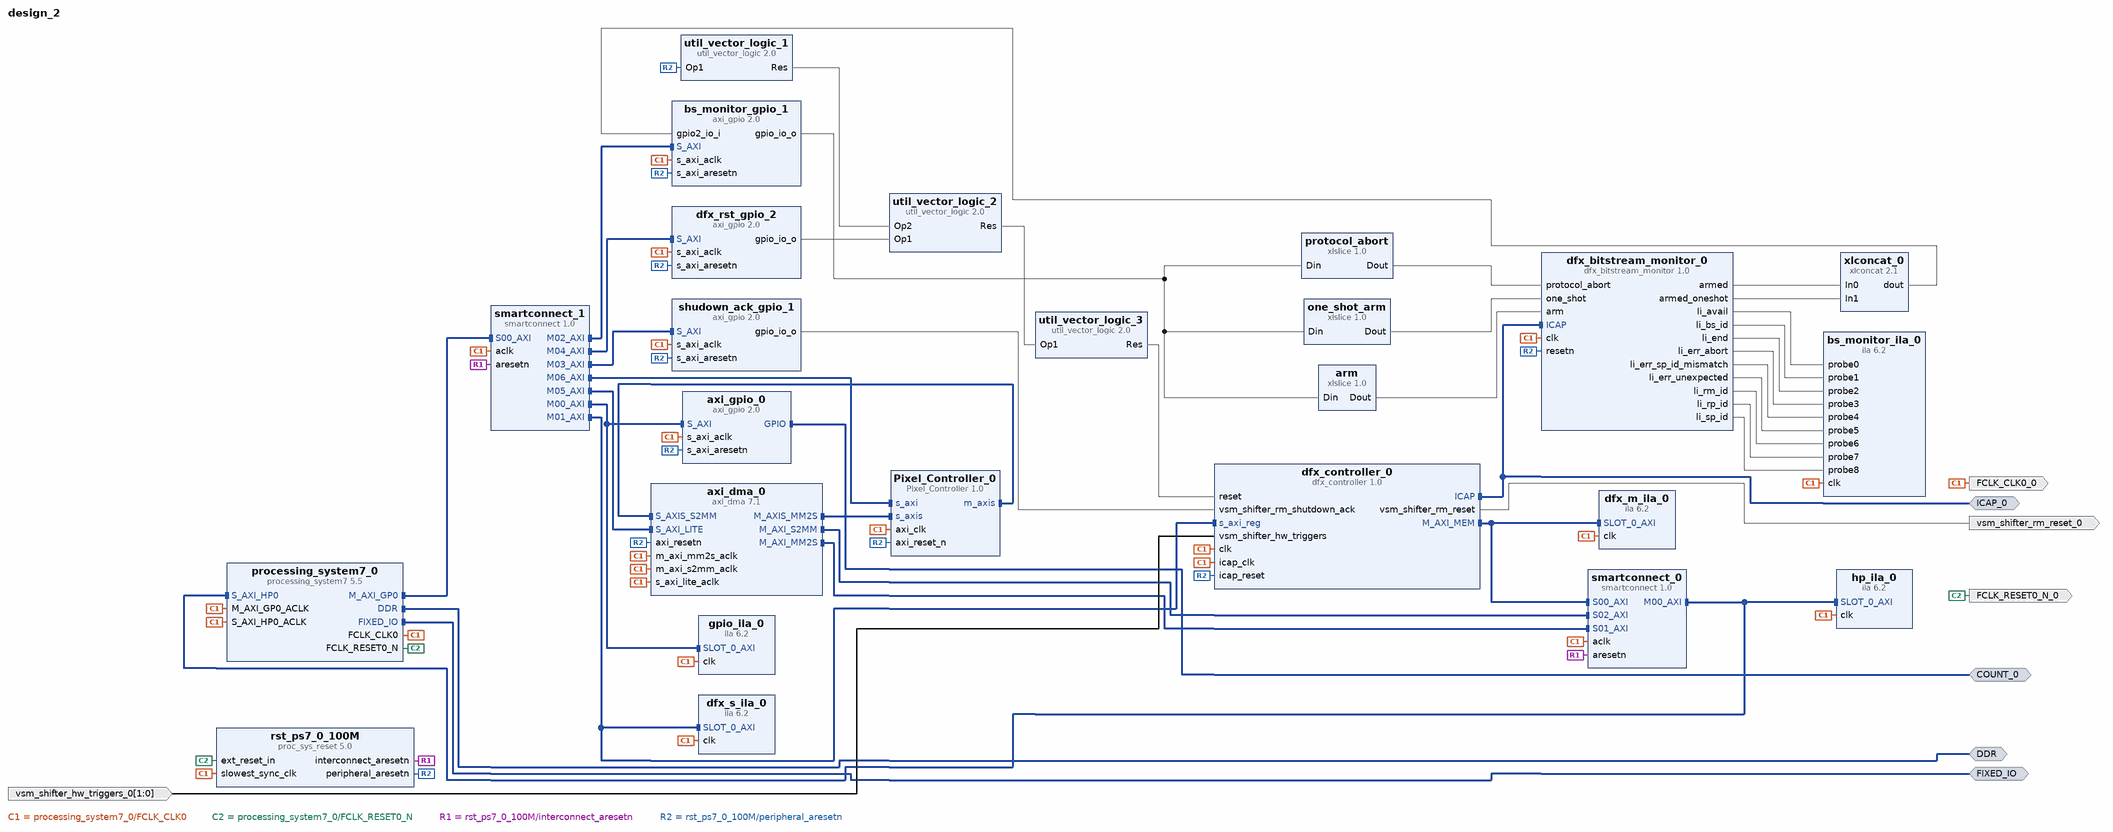
[diagram p0: block diagram of the top level]
# Vivado block design design_2, xc7z020clg400-1, Vivado 2020.1
create_bd_design design_2

create_bd_intf_port -mode Master -vlnv xilinx.com:interface:gpio_rtl:1.0 COUNT_0
create_bd_intf_port -mode Master -vlnv xilinx.com:interface:ddrx_rtl:1.0 DDR
create_bd_intf_port -mode Master -vlnv xilinx.com:display_processing_system7:fixedio_rtl:1.0 FIXED_IO
create_bd_intf_port -mode Master -vlnv xilinx.com:interface:icap_rtl:1.0 ICAP_0
create_bd_port -dir O -type clk FCLK_CLK0_0
create_bd_port -dir O -type rst FCLK_RESET0_N_0
create_bd_port -dir I -from 1 -to 0 vsm_shifter_hw_triggers_0
create_bd_port -dir O vsm_shifter_rm_reset_0

create_bd_cell -type ip -vlnv xilinx.com:ip:axi_gpio:2.0 axi_gpio_0
set_property -dict [list \
  CONFIG.C_ALL_OUTPUTS 1 \
  CONFIG.C_DOUT_DEFAULT 0x05F5E100 \
  CONFIG.C_GPIO_WIDTH 32 \
  CONFIG.GPIO_BOARD_INTERFACE Custom \
  CONFIG.USE_BOARD_FLOW true \
] [get_bd_cells axi_gpio_0]
create_bd_cell -type ip -vlnv xilinx.com:ip:dfx_controller:1.0 dfx_controller_0
set_property -dict [list \
  CONFIG.ALL_PARAMS {HAS_AXI_LITE_IF 1 RESET_ACTIVE_LEVEL 0 CP_FIFO_DEPTH 32 CP_FIFO_TYPE lutram CDC_STAGES 2 VS {shifter {ID 0 NAME shifter RM {shift_left {ID 0 NAME shift_left BS {0 {ID 0 ADDR 0 SIZE 0 CLEAR 0}} RESET_REQUIRED high} shift_right {ID 1 NAME shift_right BS {0 {ID 0 ADDR 0 SIZE 0 CLEAR 0}} RESET_REQUIRED high}} POR_RM shift_left HAS_POR_RM 1 SHUTDOWN_ON_ERROR 0 HAS_AXIS_STATUS 0 HAS_AXIS_CONTROL 0 SKIP_RM_STARTUP_AFTER_RESET 1 NUM_HW_TRIGGERS 2}} CP_FAMILY 7series DIRTY 0 CP_ARBITRATION_PROTOCOL 0} \
  CONFIG.GUI_CDC_STAGES 2 \
  CONFIG.GUI_CP_ARBITRATION_PROTOCOL 0 \
  CONFIG.GUI_HAS_AXI_LITE true \
  CONFIG.GUI_RESET_ACTIVE_LEVEL 0 \
  CONFIG.GUI_RM_NEW_NAME shift_left \
  CONFIG.GUI_RM_RESET_REQUIRED high \
  CONFIG.GUI_SELECT_RM 0 \
  CONFIG.GUI_SELECT_TRIGGER_1 1 \
  CONFIG.GUI_SELECT_TRIGGER_3 1 \
  CONFIG.GUI_VS_HAS_AXIS_CONTROL false \
  CONFIG.GUI_VS_HAS_AXIS_STATUS false \
  CONFIG.GUI_VS_HAS_POR_RM true \
  CONFIG.GUI_VS_NEW_NAME shifter \
  CONFIG.GUI_VS_NUM_HW_TRIGGERS 2 \
  CONFIG.GUI_VS_SHUTDOWN_ON_ERROR false \
  CONFIG.GUI_VS_SKIP_RM_STARTUP_AFTER_RESET true \
] [get_bd_cells dfx_controller_0]
create_bd_cell -type ip -vlnv xilinx.com:ip:processing_system7:5.5 processing_system7_0
set_property -dict [list \
  CONFIG.PCW_APU_PERIPHERAL_FREQMHZ 650 \
  CONFIG.PCW_CRYSTAL_PERIPHERAL_FREQMHZ 50 \
  CONFIG.PCW_ENET0_ENET0_IO {MIO 16 .. 27} \
  CONFIG.PCW_ENET0_GRP_MDIO_ENABLE 1 \
  CONFIG.PCW_ENET0_GRP_MDIO_IO {MIO 52 .. 53} \
  CONFIG.PCW_ENET0_PERIPHERAL_ENABLE 1 \
  CONFIG.PCW_ENET0_RESET_ENABLE 1 \
  CONFIG.PCW_ENET0_RESET_IO {MIO 9} \
  CONFIG.PCW_ENET_RESET_ENABLE 1 \
  CONFIG.PCW_ENET_RESET_SELECT {Share reset pin} \
  CONFIG.PCW_FPGA0_PERIPHERAL_FREQMHZ 100 \
  CONFIG.PCW_FPGA1_PERIPHERAL_FREQMHZ 50 \
  CONFIG.PCW_GPIO_MIO_GPIO_ENABLE 1 \
  CONFIG.PCW_GPIO_MIO_GPIO_IO MIO \
  CONFIG.PCW_I2C_RESET_ENABLE 1 \
  CONFIG.PCW_M_AXI_GP0_FREQMHZ 10 \
  CONFIG.PCW_PERIPHERAL_BOARD_PRESET part0 \
  CONFIG.PCW_PRESET_BANK1_VOLTAGE {LVCMOS 1.8V} \
  CONFIG.PCW_QSPI_GRP_FBCLK_ENABLE 1 \
  CONFIG.PCW_QSPI_GRP_FBCLK_IO {MIO 8} \
  CONFIG.PCW_QSPI_GRP_SINGLE_SS_ENABLE 1 \
  CONFIG.PCW_QSPI_GRP_SINGLE_SS_IO {MIO 1 .. 6} \
  CONFIG.PCW_QSPI_PERIPHERAL_ENABLE 1 \
  CONFIG.PCW_QSPI_QSPI_IO {MIO 1 .. 6} \
  CONFIG.PCW_SD0_GRP_CD_ENABLE 1 \
  CONFIG.PCW_SD0_GRP_CD_IO {MIO 47} \
  CONFIG.PCW_SD0_GRP_WP_ENABLE 0 \
  CONFIG.PCW_SD0_PERIPHERAL_ENABLE 1 \
  CONFIG.PCW_SD0_SD0_IO {MIO 40 .. 45} \
  CONFIG.PCW_SDIO_PERIPHERAL_FREQMHZ 50 \
  CONFIG.PCW_SINGLE_QSPI_DATA_MODE x4 \
  CONFIG.PCW_S_AXI_HP0_FREQMHZ 10 \
  CONFIG.PCW_UART0_PERIPHERAL_ENABLE 1 \
  CONFIG.PCW_UART0_UART0_IO {MIO 14 .. 15} \
  CONFIG.PCW_UART1_PERIPHERAL_ENABLE 0 \
  CONFIG.PCW_UART_PERIPHERAL_FREQMHZ 100 \
  CONFIG.PCW_UIPARAM_DDR_BUS_WIDTH {16 Bit} \
  CONFIG.PCW_UIPARAM_DDR_FREQ_MHZ 525 \
  CONFIG.PCW_UIPARAM_DDR_PARTNO {MT41J256M16 RE-125} \
  CONFIG.PCW_USB0_PERIPHERAL_ENABLE 1 \
  CONFIG.PCW_USB0_RESET_ENABLE 1 \
  CONFIG.PCW_USB0_RESET_IO {MIO 46} \
  CONFIG.PCW_USB0_USB0_IO {MIO 28 .. 39} \
  CONFIG.PCW_USB_RESET_ENABLE 1 \
  CONFIG.PCW_USB_RESET_SELECT {Share reset pin} \
  CONFIG.PCW_USE_S_AXI_HP0 1 \
] [get_bd_cells processing_system7_0]
# 498 more settings of processing_system7_0 are not shown: defaults, MIO pin electricals, DDR timing, and values the tool derives
create_bd_cell -type ip -vlnv xilinx.com:ip:proc_sys_reset:5.0 rst_ps7_0_100M
create_bd_cell -type ip -vlnv xilinx.com:ip:ila:6.2 gpio_ila_0
create_bd_cell -type ip -vlnv xilinx.com:ip:ila:6.2 dfx_s_ila_0
create_bd_cell -type ip -vlnv xilinx.com:ip:ila:6.2 dfx_m_ila_0
create_bd_cell -type ip -vlnv xilinx.com:ip:ila:6.2 hp_ila_0
create_bd_cell -type ip -vlnv xilinx.com:ip:dfx_bitstream_monitor:1.0 dfx_bitstream_monitor_0
set_property -dict [list \
  CONFIG.CTRL_INTERFACE_TYPE 0 \
  CONFIG.DP_DATA_FORMAT le_bs \
  CONFIG.DP_PROTOCOL ICAP \
  CONFIG.HAS_USR_ACCESS true \
] [get_bd_cells dfx_bitstream_monitor_0]
create_bd_cell -type ip -vlnv xilinx.com:ip:axi_gpio:2.0 bs_monitor_gpio_1
set_property -dict [list \
  CONFIG.C_ALL_INPUTS_2 1 \
  CONFIG.C_ALL_OUTPUTS 1 \
  CONFIG.C_DOUT_DEFAULT 0x00000000 \
  CONFIG.C_GPIO2_WIDTH 2 \
  CONFIG.C_GPIO_WIDTH 3 \
  CONFIG.C_IS_DUAL 1 \
  CONFIG.GPIO_BOARD_INTERFACE Custom \
  CONFIG.USE_BOARD_FLOW true \
] [get_bd_cells bs_monitor_gpio_1]
create_bd_cell -type ip -vlnv xilinx.com:ip:xlslice:1.0 arm
set_property -dict {CONFIG.DIN_WIDTH 3} [get_bd_cells arm]
create_bd_cell -type ip -vlnv xilinx.com:ip:xlslice:1.0 one_shot_arm
set_property -dict {CONFIG.DIN_FROM 1 CONFIG.DIN_TO 1 CONFIG.DIN_WIDTH 3 CONFIG.DOUT_WIDTH 1} [get_bd_cells one_shot_arm]
create_bd_cell -type ip -vlnv xilinx.com:ip:xlslice:1.0 protocol_abort
set_property -dict {CONFIG.DIN_FROM 2 CONFIG.DIN_TO 2 CONFIG.DIN_WIDTH 3 CONFIG.DOUT_WIDTH 1} [get_bd_cells protocol_abort]
create_bd_cell -type ip -vlnv xilinx.com:ip:xlconcat:2.1 xlconcat_0
set_property -dict {CONFIG.NUM_PORTS 2} [get_bd_cells xlconcat_0]
create_bd_cell -type ip -vlnv xilinx.com:ip:ila:6.2 bs_monitor_ila_0
set_property -dict [list \
  CONFIG.C_ENABLE_ILA_AXI_MON false \
  CONFIG.C_MONITOR_TYPE Native \
  CONFIG.C_NUM_OF_PROBES 9 \
  CONFIG.C_PROBE1_TYPE 1 \
  CONFIG.C_PROBE1_WIDTH 32 \
  CONFIG.C_PROBE6_TYPE 1 \
  CONFIG.C_PROBE6_WIDTH 32 \
  CONFIG.C_PROBE7_TYPE 1 \
  CONFIG.C_PROBE7_WIDTH 32 \
  CONFIG.C_PROBE8_TYPE 1 \
  CONFIG.C_PROBE8_WIDTH 32 \
] [get_bd_cells bs_monitor_ila_0]
create_bd_cell -type ip -vlnv xilinx.com:ip:axi_gpio:2.0 shudown_ack_gpio_1
set_property -dict {CONFIG.C_ALL_OUTPUTS 1 CONFIG.C_GPIO_WIDTH 1} [get_bd_cells shudown_ack_gpio_1]
create_bd_cell -type ip -vlnv xilinx.com:ip:smartconnect:1.0 smartconnect_0
set_property -dict {CONFIG.NUM_SI 3} [get_bd_cells smartconnect_0]
create_bd_cell -type ip -vlnv xilinx.com:ip:smartconnect:1.0 smartconnect_1
set_property -dict {CONFIG.NUM_MI 7 CONFIG.NUM_SI 1} [get_bd_cells smartconnect_1]
create_bd_cell -type ip -vlnv xilinx.com:ip:axi_gpio:2.0 dfx_rst_gpio_2
set_property -dict [list \
  CONFIG.C_ALL_OUTPUTS 1 \
  CONFIG.C_DOUT_DEFAULT 0xFFFFFFFF \
  CONFIG.C_GPIO_WIDTH 1 \
  CONFIG.GPIO_BOARD_INTERFACE Custom \
  CONFIG.USE_BOARD_FLOW true \
] [get_bd_cells dfx_rst_gpio_2]
create_bd_cell -type ip -vlnv xilinx.com:ip:util_vector_logic:2.0 util_vector_logic_1
set_property -dict {CONFIG.C_OPERATION not CONFIG.C_SIZE 1} [get_bd_cells util_vector_logic_1]
create_bd_cell -type ip -vlnv xilinx.com:ip:util_vector_logic:2.0 util_vector_logic_2
set_property -dict {CONFIG.C_OPERATION or CONFIG.C_SIZE 1} [get_bd_cells util_vector_logic_2]
create_bd_cell -type ip -vlnv xilinx.com:ip:util_vector_logic:2.0 util_vector_logic_3
set_property -dict {CONFIG.C_OPERATION not CONFIG.C_SIZE 1} [get_bd_cells util_vector_logic_3]
create_bd_cell -type ip -vlnv xilinx.com:ip:axi_dma:7.1 axi_dma_0
set_property -dict {CONFIG.c_include_sg 0 CONFIG.c_sg_length_width 26} [get_bd_cells axi_dma_0]
create_bd_cell -type ip -vlnv xilinx.com:user:Pixel_Controller:1.0 Pixel_Controller_0

# ---- connections ----

connect_bd_intf_net [get_bd_intf_pins Pixel_Controller_0/m_axis] [get_bd_intf_pins axi_dma_0/S_AXIS_S2MM]
connect_bd_intf_net [get_bd_intf_pins smartconnect_1/M06_AXI] [get_bd_intf_pins Pixel_Controller_0/s_axi]
connect_bd_intf_net [get_bd_intf_ports DDR] [get_bd_intf_pins processing_system7_0/DDR]
connect_bd_intf_net [get_bd_intf_pins dfx_controller_0/M_AXI_MEM] [get_bd_intf_pins smartconnect_0/S00_AXI]
connect_bd_intf_net [get_bd_intf_pins dfx_controller_0/M_AXI_MEM] [get_bd_intf_pins dfx_m_ila_0/SLOT_0_AXI]
connect_bd_intf_net [get_bd_intf_pins axi_dma_0/M_AXI_S2MM] [get_bd_intf_pins smartconnect_0/S02_AXI]
connect_bd_intf_net [get_bd_intf_pins bs_monitor_gpio_1/S_AXI] [get_bd_intf_pins smartconnect_1/M02_AXI]
connect_bd_intf_net -intf_net axi_mem_intercon_M00_AXI [get_bd_intf_pins smartconnect_0/M00_AXI] [get_bd_intf_pins processing_system7_0/S_AXI_HP0]
connect_bd_intf_net [get_bd_intf_pins smartconnect_0/M00_AXI] [get_bd_intf_pins hp_ila_0/SLOT_0_AXI]
connect_bd_intf_net [get_bd_intf_pins shudown_ack_gpio_1/S_AXI] [get_bd_intf_pins smartconnect_1/M03_AXI]
connect_bd_intf_net [get_bd_intf_ports ICAP_0] [get_bd_intf_pins dfx_controller_0/ICAP]
connect_bd_intf_net [get_bd_intf_ports ICAP_0] [get_bd_intf_pins dfx_bitstream_monitor_0/ICAP]
connect_bd_intf_net [get_bd_intf_pins smartconnect_1/M00_AXI] [get_bd_intf_pins axi_gpio_0/S_AXI]
connect_bd_intf_net [get_bd_intf_pins smartconnect_1/M00_AXI] [get_bd_intf_pins gpio_ila_0/SLOT_0_AXI]
connect_bd_intf_net [get_bd_intf_pins smartconnect_1/S00_AXI] [get_bd_intf_pins processing_system7_0/M_AXI_GP0]
connect_bd_intf_net [get_bd_intf_pins dfx_controller_0/s_axi_reg] [get_bd_intf_pins smartconnect_1/M01_AXI]
connect_bd_intf_net [get_bd_intf_pins dfx_controller_0/s_axi_reg] [get_bd_intf_pins dfx_s_ila_0/SLOT_0_AXI]
connect_bd_intf_net [get_bd_intf_pins axi_dma_0/M_AXI_MM2S] [get_bd_intf_pins smartconnect_0/S01_AXI]
connect_bd_intf_net [get_bd_intf_pins smartconnect_1/M05_AXI] [get_bd_intf_pins axi_dma_0/S_AXI_LITE]
connect_bd_intf_net [get_bd_intf_pins smartconnect_1/M04_AXI] [get_bd_intf_pins dfx_rst_gpio_2/S_AXI]
connect_bd_intf_net [get_bd_intf_ports FIXED_IO] [get_bd_intf_pins processing_system7_0/FIXED_IO]
connect_bd_intf_net [get_bd_intf_ports COUNT_0] [get_bd_intf_pins axi_gpio_0/GPIO]
connect_bd_intf_net [get_bd_intf_pins axi_dma_0/M_AXIS_MM2S] [get_bd_intf_pins Pixel_Controller_0/s_axis]
connect_bd_net [get_bd_pins processing_system7_0/FCLK_CLK0] \
  [get_bd_ports FCLK_CLK0_0] [get_bd_pins processing_system7_0/M_AXI_GP0_ACLK] [get_bd_pins rst_ps7_0_100M/slowest_sync_clk] \
  [get_bd_pins dfx_controller_0/clk] [get_bd_pins dfx_controller_0/icap_clk] \
  [get_bd_pins processing_system7_0/S_AXI_HP0_ACLK] [get_bd_pins axi_gpio_0/s_axi_aclk] [get_bd_pins gpio_ila_0/clk] \
  [get_bd_pins dfx_s_ila_0/clk] [get_bd_pins dfx_m_ila_0/clk] [get_bd_pins hp_ila_0/clk] \
  [get_bd_pins dfx_bitstream_monitor_0/clk] [get_bd_pins bs_monitor_gpio_1/s_axi_aclk] [get_bd_pins bs_monitor_ila_0/clk] \
  [get_bd_pins shudown_ack_gpio_1/s_axi_aclk] [get_bd_pins smartconnect_1/aclk] [get_bd_pins smartconnect_0/aclk] \
  [get_bd_pins dfx_rst_gpio_2/s_axi_aclk] [get_bd_pins axi_dma_0/m_axi_mm2s_aclk] [get_bd_pins axi_dma_0/m_axi_s2mm_aclk] \
  [get_bd_pins axi_dma_0/s_axi_lite_aclk] [get_bd_pins Pixel_Controller_0/axi_clk]
connect_bd_net [get_bd_pins processing_system7_0/FCLK_RESET0_N] [get_bd_ports FCLK_RESET0_N_0] [get_bd_pins rst_ps7_0_100M/ext_reset_in]
connect_bd_net -net vsm_shifter_hw_triggers_0_1 [get_bd_ports vsm_shifter_hw_triggers_0] [get_bd_pins dfx_controller_0/vsm_shifter_hw_triggers]
connect_bd_net -net xlslice_0_Dout [get_bd_pins arm/Dout] [get_bd_pins dfx_bitstream_monitor_0/arm]
connect_bd_net -net xlslice_1_Dout [get_bd_pins one_shot_arm/Dout] [get_bd_pins dfx_bitstream_monitor_0/one_shot]
connect_bd_net -net xlslice_2_Dout [get_bd_pins protocol_abort/Dout] [get_bd_pins dfx_bitstream_monitor_0/protocol_abort]
connect_bd_net -net axi_gpio_1_gpio_io_o [get_bd_pins bs_monitor_gpio_1/gpio_io_o] \
  [get_bd_pins arm/Din] [get_bd_pins one_shot_arm/Din] [get_bd_pins protocol_abort/Din]
connect_bd_net [get_bd_pins dfx_bitstream_monitor_0/armed] [get_bd_pins xlconcat_0/In0]
connect_bd_net [get_bd_pins dfx_bitstream_monitor_0/armed_oneshot] [get_bd_pins xlconcat_0/In1]
connect_bd_net [get_bd_pins xlconcat_0/dout] [get_bd_pins bs_monitor_gpio_1/gpio2_io_i]
connect_bd_net [get_bd_pins dfx_bitstream_monitor_0/li_avail] [get_bd_pins bs_monitor_ila_0/probe0]
connect_bd_net [get_bd_pins dfx_bitstream_monitor_0/li_bs_id] [get_bd_pins bs_monitor_ila_0/probe1]
connect_bd_net [get_bd_pins dfx_bitstream_monitor_0/li_end] [get_bd_pins bs_monitor_ila_0/probe2]
connect_bd_net [get_bd_pins dfx_bitstream_monitor_0/li_err_abort] [get_bd_pins bs_monitor_ila_0/probe3]
connect_bd_net [get_bd_pins dfx_bitstream_monitor_0/li_err_sp_id_mismatch] [get_bd_pins bs_monitor_ila_0/probe4]
connect_bd_net [get_bd_pins dfx_bitstream_monitor_0/li_err_unexpected] [get_bd_pins bs_monitor_ila_0/probe5]
connect_bd_net [get_bd_pins dfx_bitstream_monitor_0/li_rm_id] [get_bd_pins bs_monitor_ila_0/probe6]
connect_bd_net [get_bd_pins dfx_bitstream_monitor_0/li_rp_id] [get_bd_pins bs_monitor_ila_0/probe7]
connect_bd_net [get_bd_pins dfx_bitstream_monitor_0/li_sp_id] [get_bd_pins bs_monitor_ila_0/probe8]
connect_bd_net -net axi_gpio_1_gpio_io_o1 [get_bd_pins shudown_ack_gpio_1/gpio_io_o] [get_bd_pins dfx_controller_0/vsm_shifter_rm_shutdown_ack]
connect_bd_net [get_bd_pins dfx_controller_0/vsm_shifter_rm_reset] [get_bd_ports vsm_shifter_rm_reset_0]
connect_bd_net [get_bd_pins rst_ps7_0_100M/interconnect_aresetn] [get_bd_pins smartconnect_0/aresetn] [get_bd_pins smartconnect_1/aresetn]
connect_bd_net [get_bd_pins rst_ps7_0_100M/peripheral_aresetn] \
  [get_bd_pins shudown_ack_gpio_1/s_axi_aresetn] [get_bd_pins dfx_rst_gpio_2/s_axi_aresetn] \
  [get_bd_pins dfx_controller_0/icap_reset] [get_bd_pins axi_gpio_0/s_axi_aresetn] \
  [get_bd_pins bs_monitor_gpio_1/s_axi_aresetn] [get_bd_pins dfx_bitstream_monitor_0/resetn] \
  [get_bd_pins util_vector_logic_1/Op1] [get_bd_pins axi_dma_0/axi_resetn] [get_bd_pins Pixel_Controller_0/axi_reset_n]
connect_bd_net [get_bd_pins util_vector_logic_1/Res] [get_bd_pins util_vector_logic_2/Op2]
connect_bd_net [get_bd_pins dfx_rst_gpio_2/gpio_io_o] [get_bd_pins util_vector_logic_2/Op1]
connect_bd_net [get_bd_pins util_vector_logic_2/Res] [get_bd_pins util_vector_logic_3/Op1]
connect_bd_net [get_bd_pins util_vector_logic_3/Res] [get_bd_pins dfx_controller_0/reset]

# ---- address map ----
assign_bd_address -offset 0x00000000 -range 512M -target_address_space [get_bd_addr_spaces axi_dma_0/Data_MM2S] [get_bd_addr_segs processing_system7_0/S_AXI_HP0/HP0_DDR_LOWOCM]
assign_bd_address -offset 0x00000000 -range 512M -target_address_space [get_bd_addr_spaces axi_dma_0/Data_S2MM] [get_bd_addr_segs processing_system7_0/S_AXI_HP0/HP0_DDR_LOWOCM]
assign_bd_address -offset 0x00000000 -range 512M -target_address_space [get_bd_addr_spaces dfx_controller_0/Data] [get_bd_addr_segs processing_system7_0/S_AXI_HP0/HP0_DDR_LOWOCM]
assign_bd_address -offset 0x40400000 -range 64K -target_address_space [get_bd_addr_spaces processing_system7_0/Data] [get_bd_addr_segs axi_dma_0/S_AXI_LITE/Reg]
assign_bd_address -offset 0x41200000 -range 64K -target_address_space [get_bd_addr_spaces processing_system7_0/Data] [get_bd_addr_segs axi_gpio_0/S_AXI/Reg]
assign_bd_address -offset 0x41210000 -range 64K -target_address_space [get_bd_addr_spaces processing_system7_0/Data] [get_bd_addr_segs bs_monitor_gpio_1/S_AXI/Reg]
assign_bd_address -offset 0x41220000 -range 64K -target_address_space [get_bd_addr_spaces processing_system7_0/Data] [get_bd_addr_segs dfx_rst_gpio_2/S_AXI/Reg]
assign_bd_address -offset 0x41230000 -range 64K -target_address_space [get_bd_addr_spaces processing_system7_0/Data] [get_bd_addr_segs shudown_ack_gpio_1/S_AXI/Reg]
assign_bd_address -offset 0x43C00000 -range 64K -target_address_space [get_bd_addr_spaces processing_system7_0/Data] [get_bd_addr_segs Pixel_Controller_0/s_axi/reg0]
assign_bd_address -offset 0x43C10000 -range 64K -target_address_space [get_bd_addr_spaces processing_system7_0/Data] [get_bd_addr_segs dfx_controller_0/s_axi_reg/Reg]

validate_bd_design
save_bd_design
